# Altium project EJ3_PCB.PrjPcb
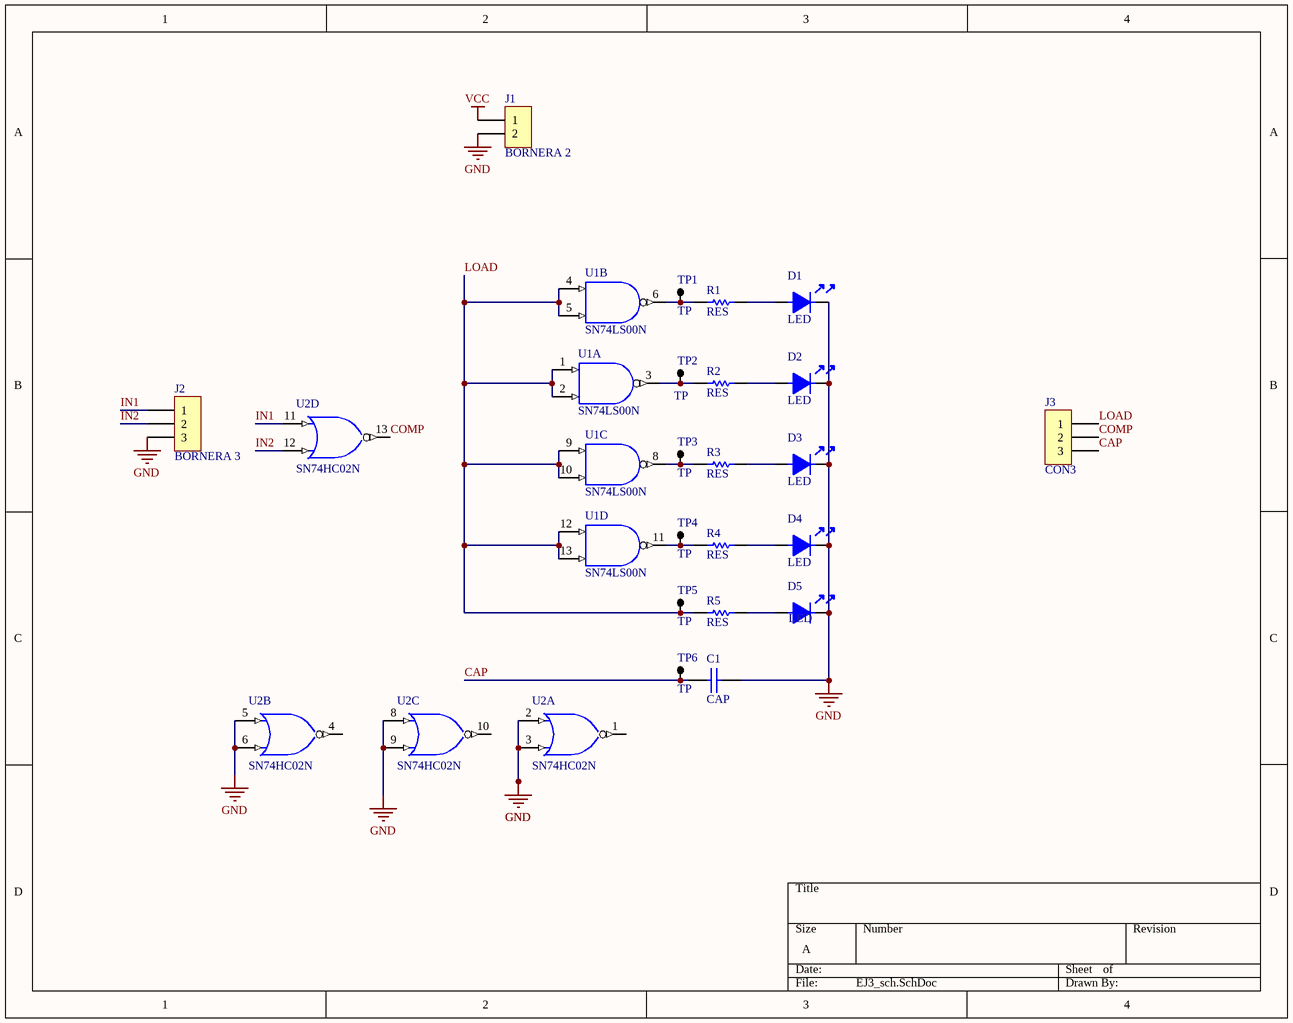
[diagram p0: EJ3_sch.SchDoc]
1 sheet, 22 parts. Net scope: global (net labels, ports and power ports of the same name join across sheets).
Board file: EJ3_pcb.PcbDoc

## Sheet EJ3_sch.SchDoc
size A

### Parts
C1  CAP  [CAP200]
D1  LED  [LED5]
D2  LED  [LED5]
D3  LED  [LED5]
D4  LED  [LED5]
D5  LED  [LED5]
J1  BORNERA 2  [BORNERA2]
J2  BORNERA 3  [BORNERA3]
J3  CON3  [SIP3]
R1  RES  [0805]
R2  RES  [0805]
R3  RES  [0805]
R4  RES  [0805]
R5  RES  [0805]
TP1  TP  [TPTH]
TP2  TP  [TPTH]
TP3  TP  [TPTH]
TP4  TP  [TPTH]
TP5  TP  [TPTH]
TP6  TP  [TPTH]
U1  SN74LS00N  [N014]  (parts A,B,C,D of 4)
U2  SN74HC02N  [N014]  (parts A,B,C,D of 4)

### Nets
GND: C1.2 D1.2 D2.2 D3.2 D4.2 D5.2 J1.2 J2.3 U1.7(GND) U2.2(A) U2.3(B) U2.5(A) U2.6(B) U2.7(GND) U2.8(A) U2.9(B)
VCC: J1.1 U1.14(VCC) U2.14(VCC)
CAP: C1.1 J3.3 TP6.1
COMP: J3.2 U2.13(Y)
IN1: J2.1 U2.11(A)
IN2: J2.2 U2.12(B)
LOAD: J3.1 R5.1 TP5.1 U1.1(A) U1.2(B) U1.4(A) U1.5(B) U1.9(A) U1.10(B) U1.12(A) U1.13(B)
NetD1_1: D1.1 R1.2
NetD2_1: D2.1 R2.2
NetD3_1: D3.1 R3.2
NetD4_1: D4.1 R4.2
NetD5_1: D5.1 R5.2
NetR1_1: R1.1 TP1.1 U1.6(Y)
NetR2_1: R2.1 TP2.1 U1.3(Y)
NetR3_1: R3.1 TP3.1 U1.8(Y)
NetR4_1: R4.1 TP4.1 U1.11(Y)

Not connected (* = marked no-connect by the designer): U2 1(Y) 4(Y) 10(Y)

### Library data of the parts
U1 = SN74LS00N: Quadruple 2-Input Positive-NAND Gate; Published: 8-Jun-2000; LatestRevisionDate: 04-Mar-2005; LatestRevisionNote: Stylized 3D Model Added.; DatasheetVersion: Mar-1988; PackageVersion: Oct-1995; PackageReference: N014; Publisher: Altium Limited; PackageDescription: DIP; 14 Leads; Row Spacing 7.62 mm; Pitch 2.54 mm; ComponentLink1Description: Manufacturer Link; ComponentLink1URL: http://www.ti.com/; ComponentLink2Description: Datasheet; ComponentLink2URL: http://www-s.ti.com/sc/ds/sn74ls00.pdf
U2 = SN74HC02N: Quadruple 2-Input Positive-NOR Gate; Published: 8-Jun-2000; LatestRevisionDate: 04-Mar-2005; LatestRevisionNote: Stylized 3D Model Added.; DatasheetVersion: May-1997; PackageVersion: Oct-1995; PackageReference: N014; Publisher: Altium Limited; PackageDescription: DIP; 14 Leads; Row Spacing 7.62 mm; Pitch 2.54 mm; ComponentLink1Description: Manufacturer Link; ComponentLink1URL: http://www.ti.com/; ComponentLink2Description: Datasheet; ComponentLink2URL: http://www-s.ti.com/sc/ds/sn74hc02.pdf